# Altium schematic sheet MAIN.schdoc
size C; SheetNumber: 5; SheetTotal: 8
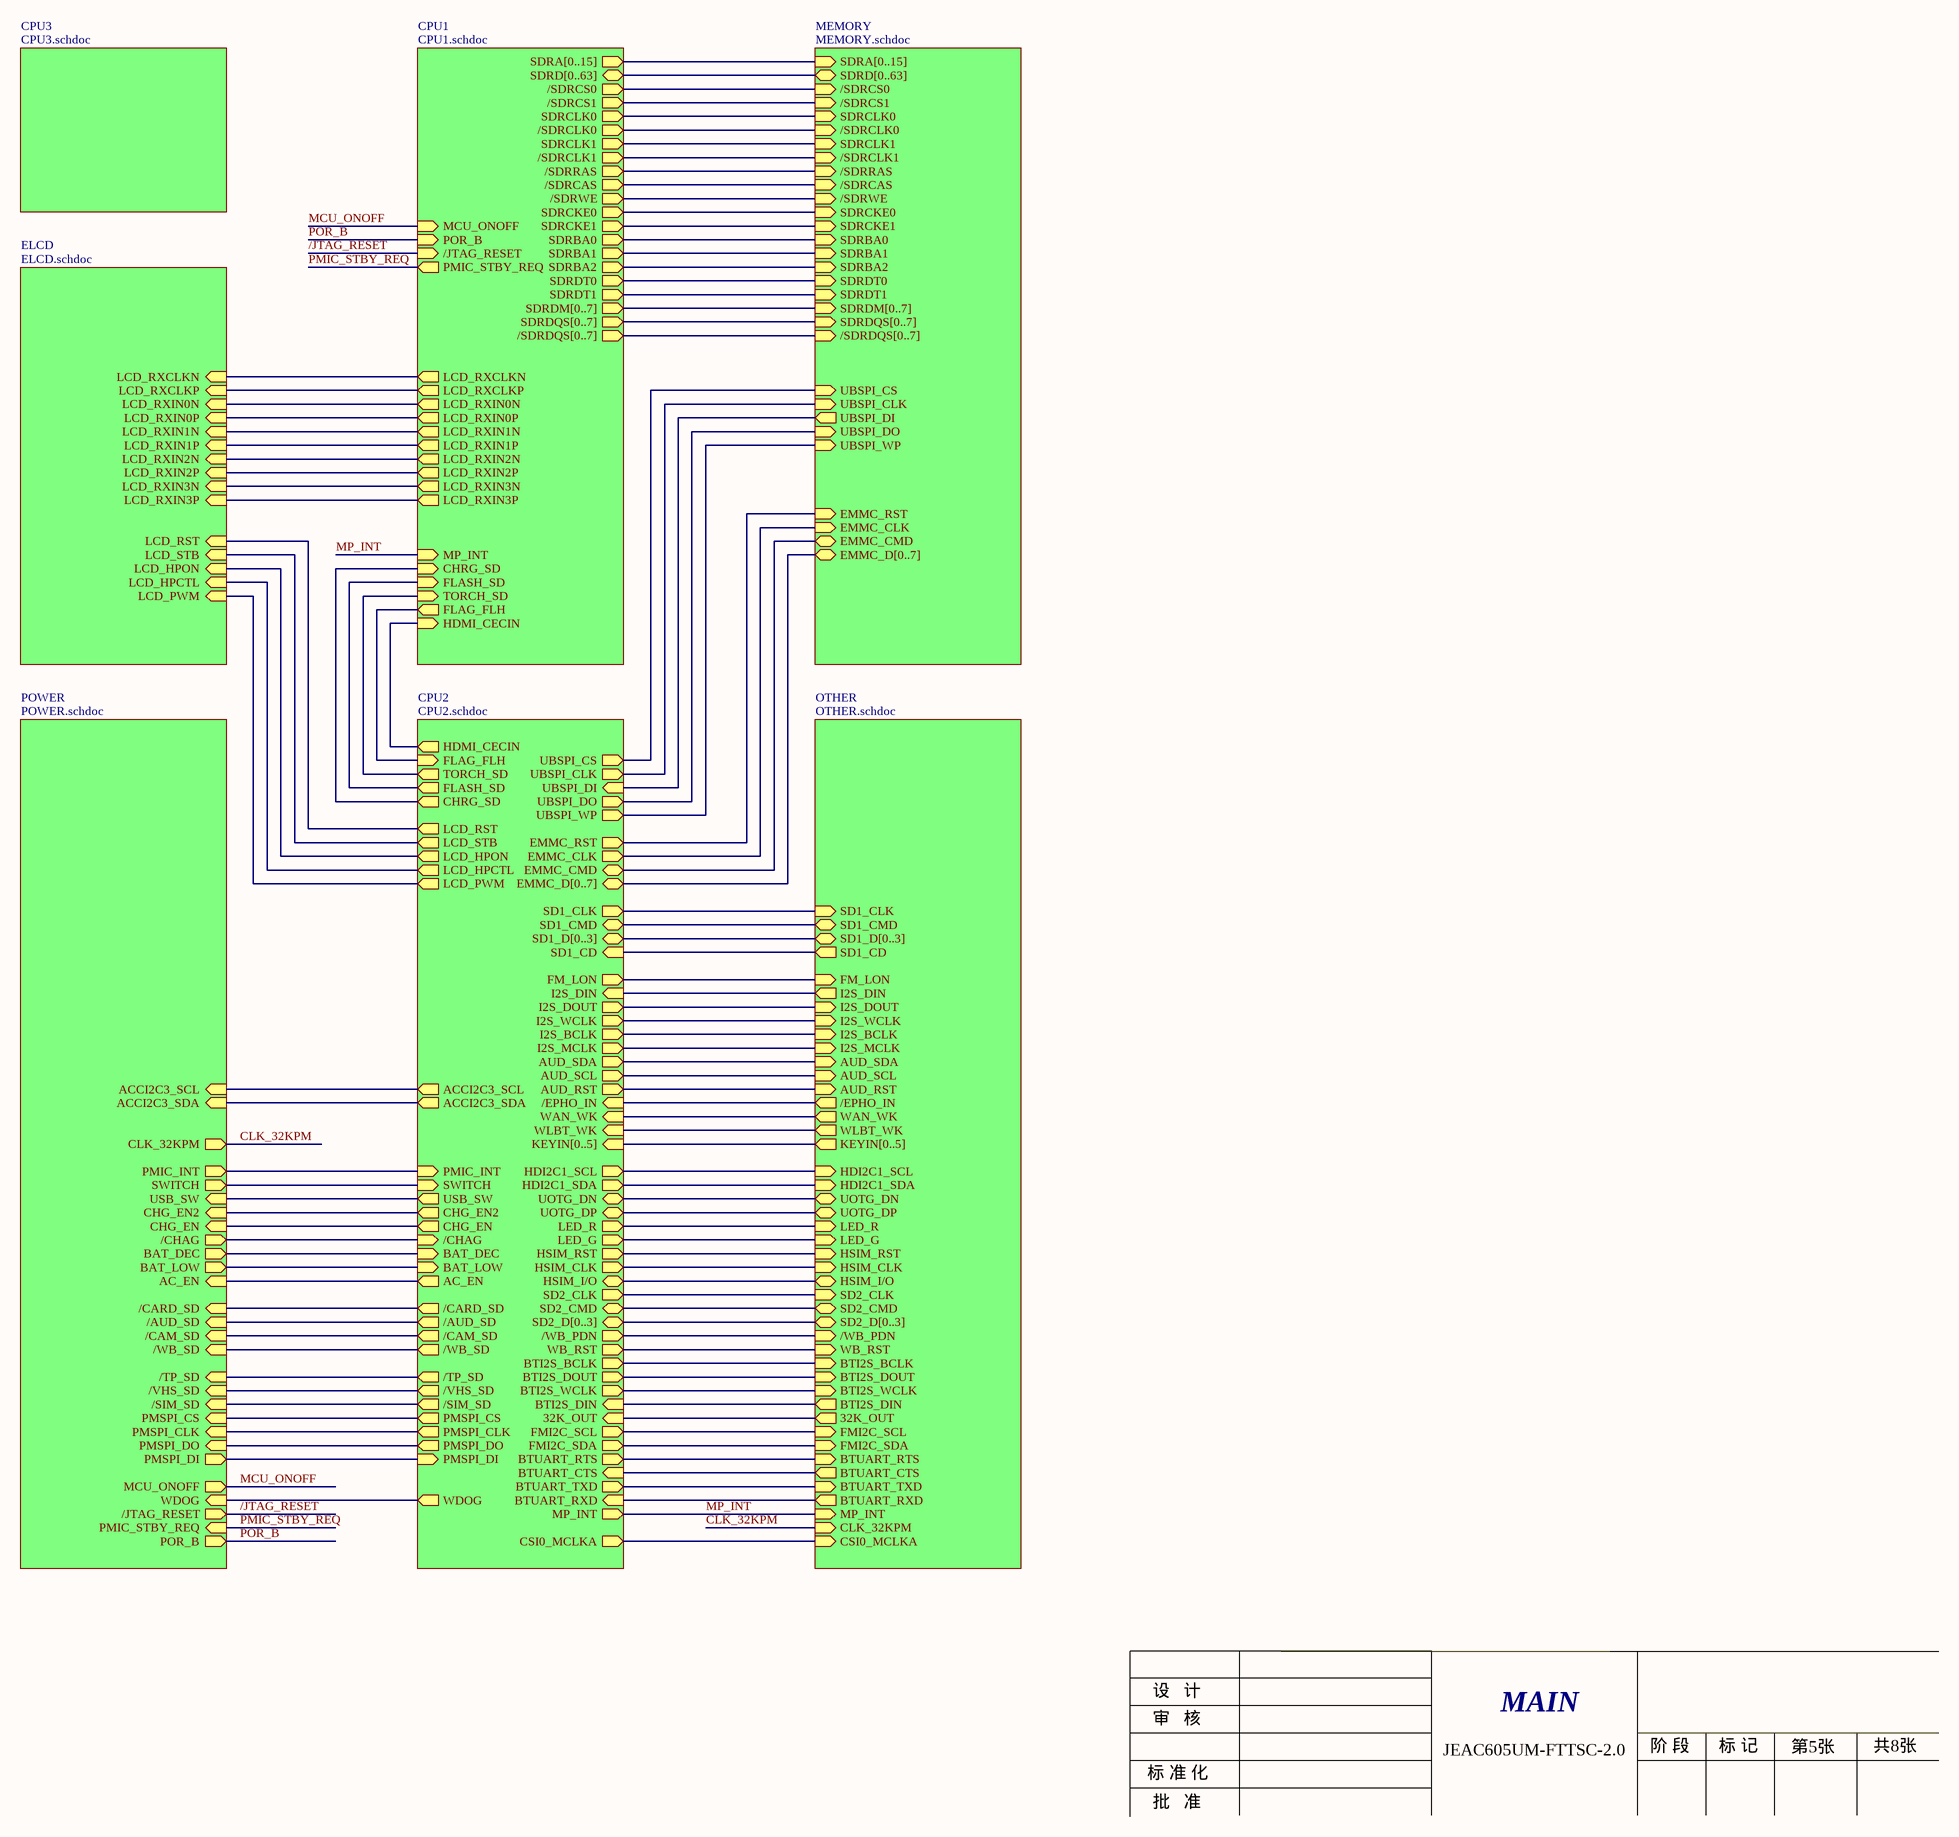
[diagram p0: MAIN.schdoc]

## Sub-sheets
CPU1 = CPU1.schdoc: /SDRCS0 (out), SDRCLK1 (out), /SDRCAS (out), /SDRRAS (out), /SDRWE (out), /SDRDQS[0..7] (out), /SDRCLK1 (out), SDRBA2 (out), SDRDQS[0..7] (out), SDRDM[0..7] (out), SDRCKE1 (out), SDRCKE0 (out), SDRA[0..15] (out), SDRD[0..63] (bidir), SDRBA0 (out), SDRBA1 (out), /JTAG_RESET (in), POR_B (in), SDRDT0 (out), SDRDT1 (out), PMIC_STBY_REQ (out), SDRCLK0 (out), /SDRCLK0 (out), LCD_RXCLKN (out), LCD_RXCLKP (out), LCD_RXIN0N (out), LCD_RXIN0P (out), LCD_RXIN1N (out), LCD_RXIN1P (out), LCD_RXIN2N (out), LCD_RXIN2P (out), LCD_RXIN3N (out), LCD_RXIN3P (out), HDMI_CECIN (in), /SDRCS1 (out), MCU_ONOFF (in), FLASH_SD (in), TORCH_SD (in), FLAG_FLH (out), CHRG_SD (in), MP_INT (in)  | Description: CPU1
CPU2 = CPU2.schdoc: /CAM_SD (out), /AUD_SD (out), /EPHO_IN (in), SWITCH (in), AUD_SDA (out), KEYIN[0..5] (in), SD2_CMD (bidir), SD2_D[0..3] (bidir), AUD_RST (out), UOTG_DN (bidir), AUD_SCL (out), I2S_DOUT (out), I2S_WCLK (out), UOTG_DP (bidir), /WB_PDN (out), /WB_SD (out), WB_RST (out), I2S_BCLK (out), I2S_MCLK (out), SD2_CLK (out), SD1_D[0..3] (bidir), SD1_CMD (bidir), SD1_CD (in), PMIC_INT (in), /VHS_SD (out), /TP_SD (out), SD1_CLK (out), WDOG (out), UBSPI_CS (out), UBSPI_DI (in), UBSPI_CLK (out), UBSPI_DO (out), UBSPI_WP (out), HSIM_RST (out), HSIM_I/O (bidir), HSIM_CLK (out), /CHAG (in), CHG_EN (out), /SIM_SD (out), LED_R (out), LED_G (out), BAT_DEC (in), EMMC_CLK (out), EMMC_CMD (bidir), EMMC_D[0..7] (bidir), EMMC_RST (out), USB_SW (out), CHG_EN2 (out), LCD_RST (out), LCD_HPON (out), LCD_STB (out), LCD_HPCTL (out), LCD_PWM (out), BTI2S_BCLK (out), BTI2S_DOUT (out), BTI2S_WCLK (out), BTI2S_DIN (in), FMI2C_SCL (out), FMI2C_SDA (out), /CARD_SD (out), 32K_OUT (in), WAN_WK (in), HDMI_CECIN (out), HDI2C1_SDA (out), HDI2C1_SCL (out), WLBT_WK (in), I2S_DIN (in), ACCI2C3_SCL (out), ACCI2C3_SDA (out), BAT_LOW (in), BTUART_RTS (out), BTUART_CTS (in), BTUART_TXD (out), BTUART_RXD (in), FM_LON (out), PMSPI_CS (out), PMSPI_CLK (out), PMSPI_DO (out), PMSPI_DI (in), AC_EN (out), FLAG_FLH (in), TORCH_SD (out), FLASH_SD (out), CHRG_SD (out), MP_INT (out), CSI0_MCLKA (out)  | Description: CPU2
CPU3 = CPU3.schdoc: no entries  | Description: epaper
ELCD = ELCD.schdoc: LCD_RXIN2P (in), LCD_RXIN3P (in), LCD_RXCLKP (in), LCD_RST (in), LCD_STB (in), LCD_PWM (in), LCD_RXCLKN (in), LCD_RXIN1N (in), LCD_RXIN1P (in), LCD_RXIN2N (in), LCD_RXIN3N (in), LCD_HPON (in), LCD_HPCTL (in), LCD_RXIN0N (in), LCD_RXIN0P (in)  | Description: epaper
MEMORY = MEMORY.schdoc: /SDRCS0 (in), /SDRRAS (in), /SDRCAS (in), /SDRCLK1 (in), SDRCLK1 (in), SDRDQS[0..7] (in), SDRDM[0..7] (in), /SDRWE (in), SDRCKE0 (in), SDRCKE1 (in), SDRA[0..15] (in), SDRD[0..63] (bidir), SDRBA0 (in), SDRBA1 (in), UBSPI_DI (out), UBSPI_CLK (in), UBSPI_WP (in), UBSPI_DO (in), UBSPI_CS (in), SDRBA2 (in), /SDRDQS[0..7] (in), /SDRCS1 (in), SDRDT0 (in), SDRDT1 (in), SDRCLK0 (in), /SDRCLK0 (in), EMMC_RST (in), EMMC_CLK (in), EMMC_D[0..7] (bidir), EMMC_CMD (bidir)  | Description: MEMORY
OTHER = OTHER.schdoc: AUD_SCL (in), SD2_D[0..3] (bidir), SD2_CMD (bidir), SD2_CLK (in), AUD_SDA (in), /EPHO_IN (out), KEYIN[0..5] (out), WB_RST (in), UOTG_DN (bidir), /WB_PDN (in), I2S_WCLK (in), I2S_BCLK (in), I2S_MCLK (in), I2S_DOUT (in), UOTG_DP (bidir), AUD_RST (in), SD1_CLK (in), SD1_D[0..3] (bidir), SD1_CMD (bidir), SD1_CD (out), HSIM_RST (in), HSIM_CLK (in), HSIM_I/O (bidir), LED_R (in), LED_G (in), BTI2S_BCLK (in), BTI2S_DOUT (in), BTI2S_WCLK (in), BTI2S_DIN (out), FMI2C_SCL (in), FMI2C_SDA (in), 32K_OUT (out), WAN_WK (out), WLBT_WK (out), I2S_DIN (out), BTUART_RTS (in), BTUART_CTS (out), BTUART_TXD (in), BTUART_RXD (out), FM_LON (in), CLK_32KPM (in), MP_INT (in), CSI0_MCLKA (in), HDI2C1_SCL (in), HDI2C1_SDA (in)  | Description: audio&CARD&KEY
POWER = POWER.schdoc: /JTAG_RESET (out), PMIC_STBY_REQ (in), POR_B (out), WDOG (in), SWITCH (out), /CAM_SD (in), /AUD_SD (in), /WB_SD (in), /TP_SD (in), /VHS_SD (in), PMIC_INT (out), /CHAG (out), CHG_EN (in), /SIM_SD (in), BAT_DEC (out), USB_SW (in), CHG_EN2 (in), /CARD_SD (in), MCU_ONOFF (out), ACCI2C3_SCL (in), ACCI2C3_SDA (in), BAT_LOW (out), PMSPI_DO (in), PMSPI_CLK (in), PMSPI_CS (in), PMSPI_DI (out), CLK_32KPM (out), AC_EN (in)  | Description: epaper

## Nets
/JTAG_RESET: sheet CPU1//JTAG_RESET, sheet POWER//JTAG_RESET
CLK_32KPM: sheet OTHER/CLK_32KPM, sheet POWER/CLK_32KPM
MCU_ONOFF: sheet CPU1/MCU_ONOFF, sheet POWER/MCU_ONOFF
MP_INT: sheet CPU1/MP_INT, sheet CPU2/MP_INT, sheet OTHER/MP_INT
PMIC_STBY_REQ: sheet CPU1/PMIC_STBY_REQ, sheet POWER/PMIC_STBY_REQ
POR_B: sheet CPU1/POR_B, sheet POWER/POR_B
(unnamed): sheet MEMORY//SDRCS0, sheet CPU1//SDRCS0
(unnamed): sheet MEMORY//SDRRAS, sheet CPU1//SDRRAS
(unnamed): sheet MEMORY//SDRCAS, sheet CPU1//SDRCAS
(unnamed): sheet MEMORY//SDRCLK1, sheet CPU1//SDRCLK1
(unnamed): sheet MEMORY/SDRCLK1, sheet CPU1/SDRCLK1
(unnamed): sheet MEMORY//SDRWE, sheet CPU1//SDRWE
(unnamed): sheet MEMORY/SDRCKE0, sheet CPU1/SDRCKE0
(unnamed): sheet MEMORY/SDRCKE1, sheet CPU1/SDRCKE1
(unnamed): sheet MEMORY/SDRBA0, sheet CPU1/SDRBA0
(unnamed): sheet MEMORY/SDRBA1, sheet CPU1/SDRBA1
(unnamed): sheet MEMORY/UBSPI_DI, sheet CPU2/UBSPI_DI
(unnamed): sheet MEMORY/UBSPI_CLK, sheet CPU2/UBSPI_CLK
(unnamed): sheet MEMORY/UBSPI_WP, sheet CPU2/UBSPI_WP
(unnamed): sheet MEMORY/UBSPI_DO, sheet CPU2/UBSPI_DO
(unnamed): sheet MEMORY/UBSPI_CS, sheet CPU2/UBSPI_CS
(unnamed): sheet MEMORY/SDRBA2, sheet CPU1/SDRBA2
(unnamed): sheet MEMORY//SDRCS1, sheet CPU1//SDRCS1
(unnamed): sheet MEMORY/SDRDT0, sheet CPU1/SDRDT0
(unnamed): sheet MEMORY/SDRDT1, sheet CPU1/SDRDT1
(unnamed): sheet MEMORY/SDRCLK0, sheet CPU1/SDRCLK0
(unnamed): sheet MEMORY//SDRCLK0, sheet CPU1//SDRCLK0
(unnamed): sheet MEMORY/EMMC_RST, sheet CPU2/EMMC_RST
(unnamed): sheet MEMORY/EMMC_CLK, sheet CPU2/EMMC_CLK
(unnamed): sheet MEMORY/EMMC_CMD, sheet CPU2/EMMC_CMD
(unnamed): sheet CPU1/LCD_RXCLKN, sheet ELCD/LCD_RXCLKN
(unnamed): sheet CPU1/LCD_RXCLKP, sheet ELCD/LCD_RXCLKP
(unnamed): sheet CPU1/LCD_RXIN0N, sheet ELCD/LCD_RXIN0N
(unnamed): sheet CPU1/LCD_RXIN0P, sheet ELCD/LCD_RXIN0P
(unnamed): sheet CPU1/LCD_RXIN1N, sheet ELCD/LCD_RXIN1N
(unnamed): sheet CPU1/LCD_RXIN1P, sheet ELCD/LCD_RXIN1P
(unnamed): sheet CPU1/LCD_RXIN2N, sheet ELCD/LCD_RXIN2N
(unnamed): sheet CPU1/LCD_RXIN2P, sheet ELCD/LCD_RXIN2P
(unnamed): sheet CPU1/LCD_RXIN3N, sheet ELCD/LCD_RXIN3N
(unnamed): sheet CPU1/LCD_RXIN3P, sheet ELCD/LCD_RXIN3P
(unnamed): sheet CPU1/HDMI_CECIN, sheet CPU2/HDMI_CECIN
(unnamed): sheet CPU1/FLASH_SD, sheet CPU2/FLASH_SD
(unnamed): sheet CPU1/TORCH_SD, sheet CPU2/TORCH_SD
(unnamed): sheet CPU1/FLAG_FLH, sheet CPU2/FLAG_FLH
(unnamed): sheet CPU1/CHRG_SD, sheet CPU2/CHRG_SD
(unnamed): sheet CPU2//CAM_SD, sheet POWER//CAM_SD
(unnamed): sheet CPU2//AUD_SD, sheet POWER//AUD_SD
(unnamed): sheet CPU2//EPHO_IN, sheet OTHER//EPHO_IN
(unnamed): sheet CPU2/SWITCH, sheet POWER/SWITCH
(unnamed): sheet CPU2/AUD_SDA, sheet OTHER/AUD_SDA
(unnamed): sheet CPU2/SD2_CMD, sheet OTHER/SD2_CMD
(unnamed): sheet CPU2/AUD_RST, sheet OTHER/AUD_RST
(unnamed): sheet CPU2/UOTG_DN, sheet OTHER/UOTG_DN
(unnamed): sheet CPU2/AUD_SCL, sheet OTHER/AUD_SCL
(unnamed): sheet CPU2/I2S_DOUT, sheet OTHER/I2S_DOUT
(unnamed): sheet CPU2/I2S_WCLK, sheet OTHER/I2S_WCLK
(unnamed): sheet CPU2/UOTG_DP, sheet OTHER/UOTG_DP
(unnamed): sheet CPU2//WB_PDN, sheet OTHER//WB_PDN
(unnamed): sheet CPU2//WB_SD, sheet POWER//WB_SD
(unnamed): sheet CPU2/WB_RST, sheet OTHER/WB_RST
(unnamed): sheet CPU2/I2S_BCLK, sheet OTHER/I2S_BCLK
(unnamed): sheet CPU2/I2S_MCLK, sheet OTHER/I2S_MCLK
(unnamed): sheet CPU2/SD2_CLK, sheet OTHER/SD2_CLK
(unnamed): sheet CPU2/SD1_CMD, sheet OTHER/SD1_CMD
(unnamed): sheet CPU2/SD1_CD, sheet OTHER/SD1_CD
(unnamed): sheet CPU2/PMIC_INT, sheet POWER/PMIC_INT
(unnamed): sheet CPU2//VHS_SD, sheet POWER//VHS_SD
(unnamed): sheet CPU2//TP_SD, sheet POWER//TP_SD
(unnamed): sheet CPU2/SD1_CLK, sheet OTHER/SD1_CLK
(unnamed): sheet CPU2/WDOG, sheet POWER/WDOG
(unnamed): sheet CPU2/HSIM_RST, sheet OTHER/HSIM_RST
(unnamed): sheet CPU2/HSIM_I/O, sheet OTHER/HSIM_I/O
(unnamed): sheet CPU2/HSIM_CLK, sheet OTHER/HSIM_CLK
(unnamed): sheet CPU2//CHAG, sheet POWER//CHAG
(unnamed): sheet CPU2/CHG_EN, sheet POWER/CHG_EN
(unnamed): sheet CPU2//SIM_SD, sheet POWER//SIM_SD
(unnamed): sheet CPU2/LED_R, sheet OTHER/LED_R
(unnamed): sheet CPU2/LED_G, sheet OTHER/LED_G
(unnamed): sheet CPU2/BAT_DEC, sheet POWER/BAT_DEC
(unnamed): sheet CPU2/USB_SW, sheet POWER/USB_SW
(unnamed): sheet CPU2/CHG_EN2, sheet POWER/CHG_EN2
(unnamed): sheet CPU2/LCD_RST, sheet ELCD/LCD_RST
(unnamed): sheet CPU2/LCD_HPON, sheet ELCD/LCD_HPON
(unnamed): sheet CPU2/LCD_STB, sheet ELCD/LCD_STB
(unnamed): sheet CPU2/LCD_HPCTL, sheet ELCD/LCD_HPCTL
(unnamed): sheet CPU2/LCD_PWM, sheet ELCD/LCD_PWM
(unnamed): sheet CPU2/BTI2S_BCLK, sheet OTHER/BTI2S_BCLK
(unnamed): sheet CPU2/BTI2S_DOUT, sheet OTHER/BTI2S_DOUT
(unnamed): sheet CPU2/BTI2S_WCLK, sheet OTHER/BTI2S_WCLK
(unnamed): sheet CPU2/BTI2S_DIN, sheet OTHER/BTI2S_DIN
(unnamed): sheet CPU2/FMI2C_SCL, sheet OTHER/FMI2C_SCL
(unnamed): sheet CPU2/FMI2C_SDA, sheet OTHER/FMI2C_SDA
(unnamed): sheet CPU2//CARD_SD, sheet POWER//CARD_SD
(unnamed): sheet CPU2/32K_OUT, sheet OTHER/32K_OUT
(unnamed): sheet CPU2/WAN_WK, sheet OTHER/WAN_WK
(unnamed): sheet CPU2/HDI2C1_SDA, sheet OTHER/HDI2C1_SDA
(unnamed): sheet CPU2/HDI2C1_SCL, sheet OTHER/HDI2C1_SCL
(unnamed): sheet CPU2/WLBT_WK, sheet OTHER/WLBT_WK
(unnamed): sheet CPU2/I2S_DIN, sheet OTHER/I2S_DIN
(unnamed): sheet CPU2/ACCI2C3_SCL, sheet POWER/ACCI2C3_SCL
(unnamed): sheet CPU2/ACCI2C3_SDA, sheet POWER/ACCI2C3_SDA
(unnamed): sheet CPU2/BAT_LOW, sheet POWER/BAT_LOW
(unnamed): sheet CPU2/BTUART_RTS, sheet OTHER/BTUART_RTS
(unnamed): sheet CPU2/BTUART_CTS, sheet OTHER/BTUART_CTS
(unnamed): sheet CPU2/BTUART_TXD, sheet OTHER/BTUART_TXD
(unnamed): sheet CPU2/BTUART_RXD, sheet OTHER/BTUART_RXD
(unnamed): sheet CPU2/FM_LON, sheet OTHER/FM_LON
(unnamed): sheet CPU2/PMSPI_CS, sheet POWER/PMSPI_CS
(unnamed): sheet CPU2/PMSPI_CLK, sheet POWER/PMSPI_CLK
(unnamed): sheet CPU2/PMSPI_DO, sheet POWER/PMSPI_DO
(unnamed): sheet CPU2/PMSPI_DI, sheet POWER/PMSPI_DI
(unnamed): sheet CPU2/AC_EN, sheet POWER/AC_EN
(unnamed): sheet CPU2/CSI0_MCLKA, sheet OTHER/CSI0_MCLKA

## Buses and harness runs
bus sheet CPU1//SDRDQS[0..7] = sheet MEMORY//SDRDQS[0..7]
bus sheet CPU1/SDRA[0..15] = sheet MEMORY/SDRA[0..15]
bus sheet CPU1/SDRD[0..63] = sheet MEMORY/SDRD[0..63]
bus sheet CPU1/SDRDM[0..7] = sheet MEMORY/SDRDM[0..7]
bus sheet CPU1/SDRDQS[0..7] = sheet MEMORY/SDRDQS[0..7]
bus sheet CPU2/EMMC_D[0..7] = sheet MEMORY/EMMC_D[0..7]
bus sheet CPU2/KEYIN[0..5] = sheet OTHER/KEYIN[0..5]
bus sheet CPU2/SD1_D[0..3] = sheet OTHER/SD1_D[0..3]
bus sheet CPU2/SD2_D[0..3] = sheet OTHER/SD2_D[0..3]

## Notes on the sheet
- 设   计
- 审   核
- MAIN
- 标 准 化
- 批   准
- JEAC605UM-FTTSC-2.0
- 阶 段
- 标 记
- 第5张
- 共8张